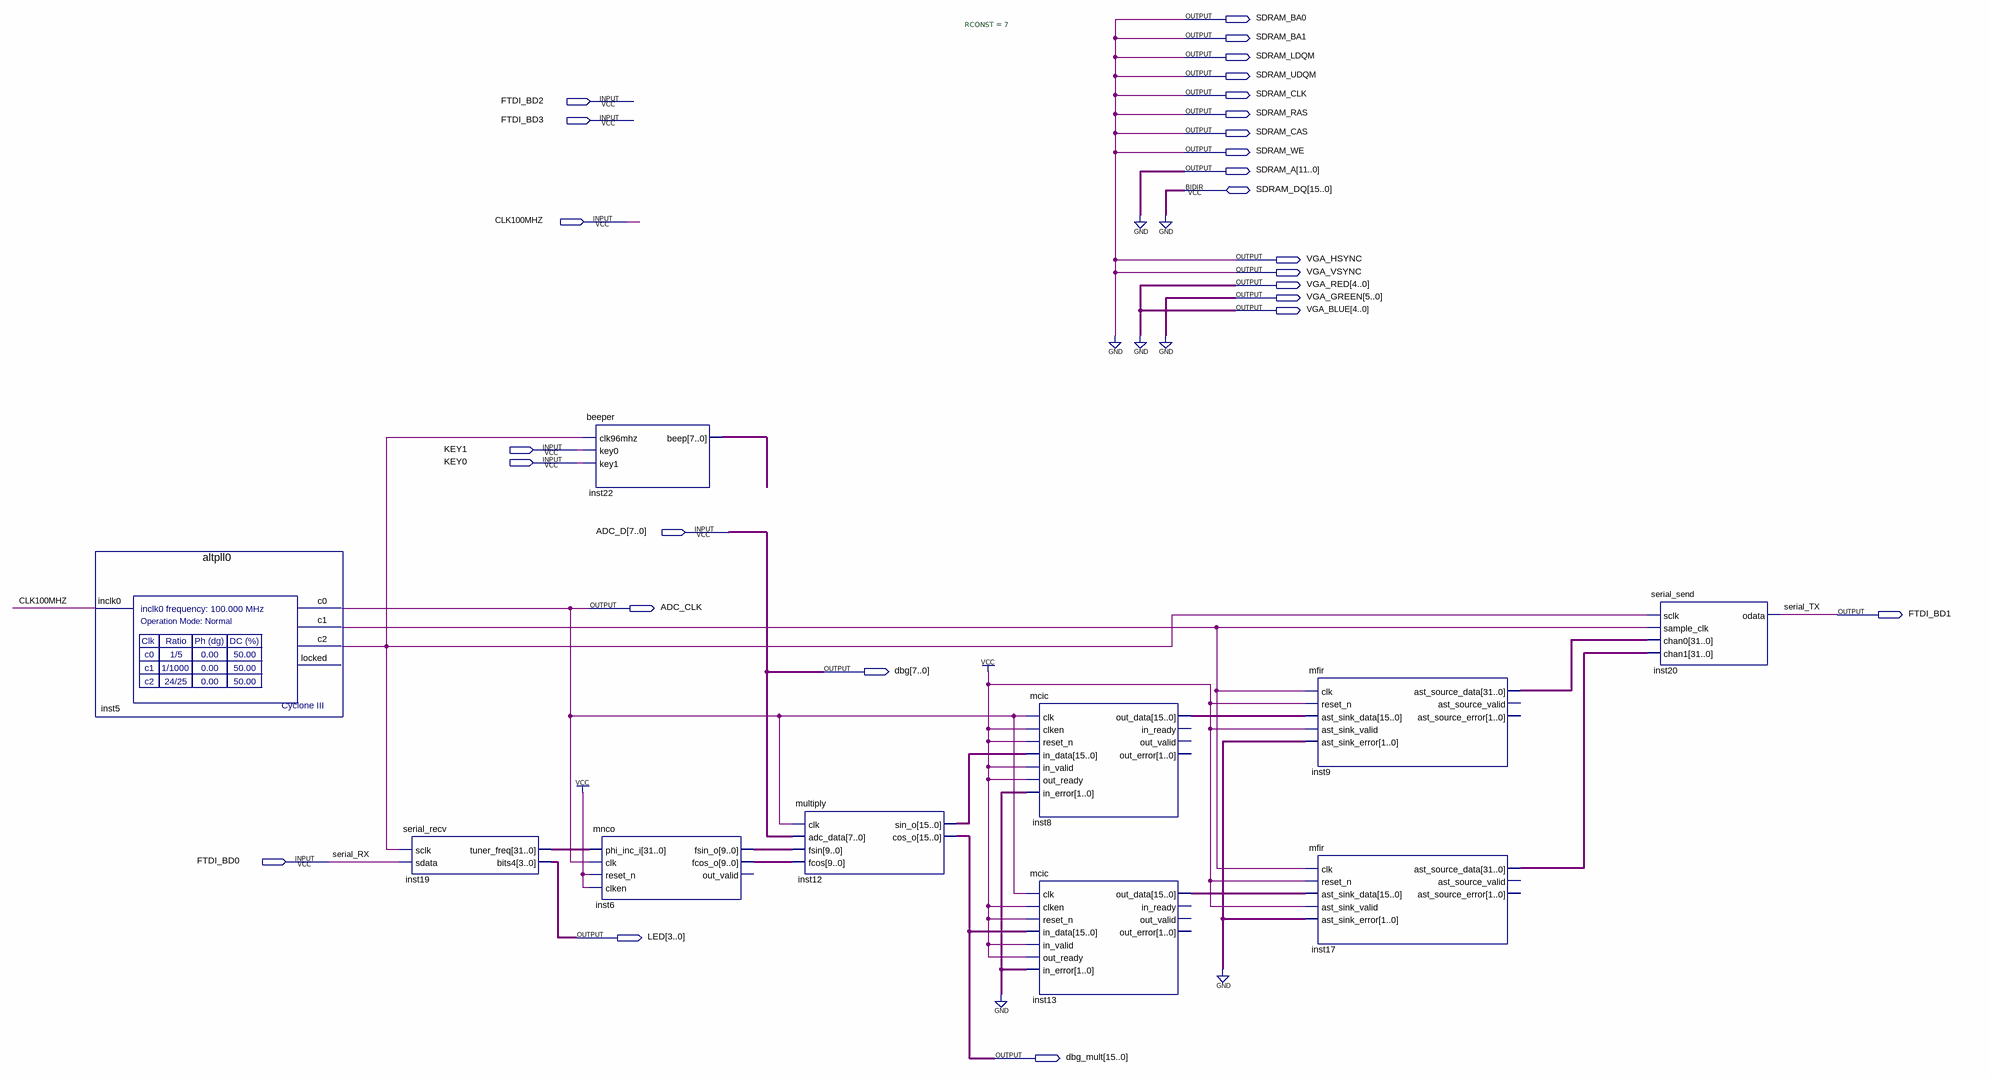
[diagram p0: schematic sheet]
// Quartus schematic cyclone3.bdf as structural Verilog: 10 symbols, 27 pins
module cyclone3 (
  input  FTDI_BD2,
  input  FTDI_BD3,
  input  CLK100MHZ,
  input  KEY1,
  input  KEY0,
  input  [7:0] ADC_D,
  input  FTDI_BD0,
  inout  [15:0] SDRAM_DQ,
  output SDRAM_BA0,
  output SDRAM_BA1,
  output SDRAM_LDQM,
  output SDRAM_UDQM,
  output SDRAM_CLK,
  output SDRAM_RAS,
  output SDRAM_CAS,
  output SDRAM_WE,
  output [11:0] SDRAM_A,
  output VGA_HSYNC,
  output VGA_VSYNC,
  output [4:0] VGA_RED,
  output [5:0] VGA_GREEN,
  output [4:0] VGA_BLUE,
  output ADC_CLK,
  output FTDI_BD1,
  output [7:0] dbg,
  output [3:0] LED,
  output [15:0] dbg_mult
);

  wire inst5_c1, inst5_c2;
  wire [7:0] inst22_beep;
  wire [9:0] inst6_fcos_o, inst6_fsin_o;
  wire [15:0] inst8_out_data, inst12_sin_o, inst13_out_data;
  wire [31:0] inst9_ast_source_data, inst17_ast_source_data, inst19_tuner_freq;

  altpll0 inst5 (.inclk0(CLK100MHZ), .c0(ADC_CLK), .c1(inst5_c1), .c2(inst5_c2));  // open: locked
  serial_recv #(.RCONST(7)) inst19 (.sclk(inst5_c2), .sdata(FTDI_BD0), .tuner_freq(inst19_tuner_freq), .bits4(LED));
  beeper inst22 (.clk96mhz(inst5_c2), .key0(KEY1), .key1(KEY0), .beep(inst22_beep));
  mnco inst6 (
    .phi_inc_i(inst19_tuner_freq), .clk(ADC_CLK), .reset_n(1'b1), .clken(1'b1), .fsin_o(inst6_fsin_o),
    .fcos_o(inst6_fcos_o));  // open: out_valid
  multiply inst12 (
    .clk(ADC_CLK), .adc_data(ADC_D), .fsin(inst6_fsin_o), .fcos(inst6_fcos_o), .sin_o(inst12_sin_o),
    .cos_o(dbg_mult));
  mcic inst8 (
    .clk(ADC_CLK), .clken(1'b1), .reset_n(1'b1), .in_data(inst12_sin_o), .in_valid(1'b1), .out_ready(1'b1),
    .in_error(2'b00), .out_data(inst8_out_data));  // open: in_ready, out_valid, out_error
  mcic inst13 (
    .clk(ADC_CLK), .clken(1'b1), .reset_n(1'b1), .in_data(dbg_mult), .in_valid(1'b1), .out_ready(1'b1),
    .in_error(2'b00), .out_data(inst13_out_data));  // open: in_ready, out_valid, out_error
  mfir inst9 (
    .clk(inst5_c1), .reset_n(1'b1), .ast_sink_data(inst8_out_data), .ast_sink_valid(1'b1),
    .ast_sink_error(2'b00), .ast_source_data(inst9_ast_source_data));  // open: ast_source_valid, ast_source_error
  mfir inst17 (
    .clk(inst5_c1), .reset_n(1'b1), .ast_sink_data(inst13_out_data), .ast_sink_valid(1'b1),
    .ast_sink_error(2'b00), .ast_source_data(inst17_ast_source_data));  // open: ast_source_valid, ast_source_error
  serial_send inst20 (
    .sclk(inst5_c2), .sample_clk(inst5_c1), .chan0(inst9_ast_source_data), .chan1(inst17_ast_source_data),
    .odata(FTDI_BD1));

  assign dbg = ADC_D;
  assign SDRAM_A = {12{1'b0}};
  assign SDRAM_BA0 = 1'b0;
  assign SDRAM_BA1 = 1'b0;
  assign SDRAM_CAS = 1'b0;
  assign SDRAM_CLK = 1'b0;
  assign SDRAM_LDQM = 1'b0;
  assign SDRAM_RAS = 1'b0;
  assign SDRAM_UDQM = 1'b0;
  assign SDRAM_WE = 1'b0;
  assign VGA_BLUE = {5{1'b0}};
  assign VGA_GREEN = {6{1'b0}};
  assign VGA_HSYNC = 1'b0;
  assign VGA_RED = {5{1'b0}};
  assign VGA_VSYNC = 1'b0;
  // also tied to GND on the sheet: {SDRAM_DQ[0], SDRAM_DQ[1], SDRAM_DQ[2], SDRAM_DQ[3], SDRAM_DQ[4], SDRAM_DQ[5], SDRAM_DQ[6], SDRAM_DQ[7], SDRAM_DQ[8], SDRAM_DQ[9], SDRAM_DQ[10], SDRAM_DQ[11], SDRAM_DQ[12], SDRAM_DQ[13], SDRAM_DQ[14], SDRAM_DQ[15]}

  // Other names for the same wires on the sheet: serial_RX = FTDI_BD0; serial_TX = FTDI_BD1
endmodule
